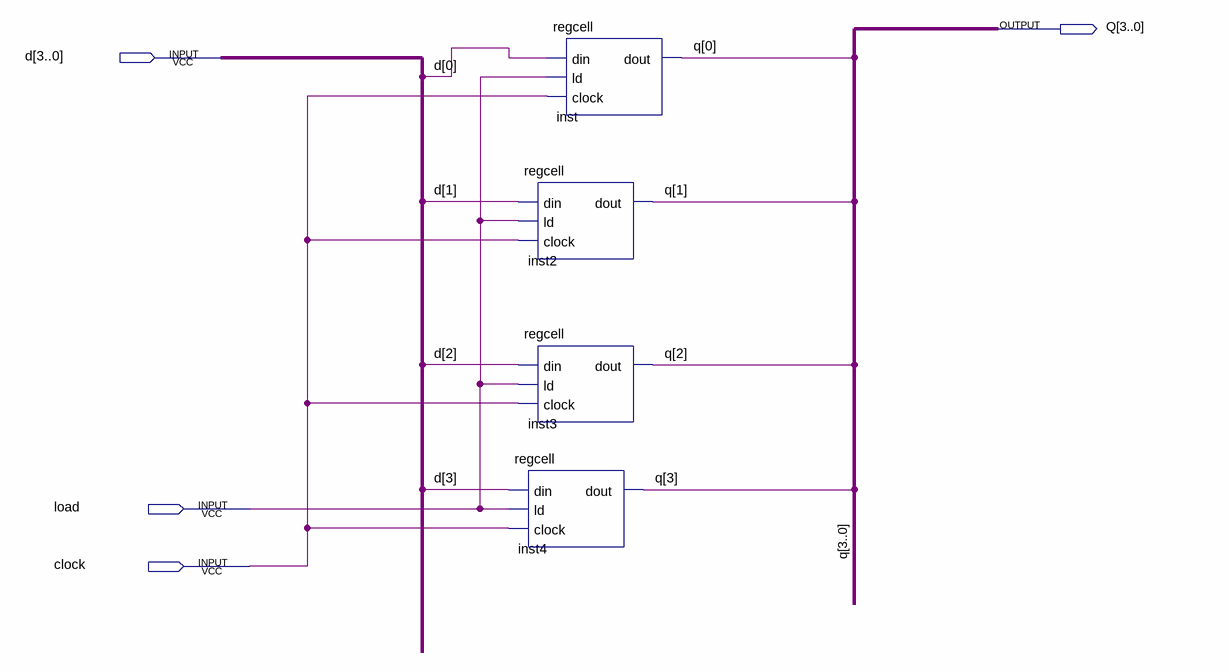
[diagram p0: schematic sheet]
// Quartus schematic registerfourbit.bdf as structural Verilog: 4 symbols, 4 pins
module registerfourbit (
  input  [3:0] d,
  input  load,
  input  clock,
  output [3:0] Q
);

  regcell inst (.din(d[0]), .ld(load), .clock(clock), .dout(Q[0]));
  regcell inst2 (.din(d[1]), .ld(load), .clock(clock), .dout(Q[1]));
  regcell inst3 (.din(d[2]), .ld(load), .clock(clock), .dout(Q[2]));
  regcell inst4 (.din(d[3]), .ld(load), .clock(clock), .dout(Q[3]));
endmodule
